# Altium schematic sheet sch power.SchDoc
size A4; SheetNumber: 1; SheetTotal: 1
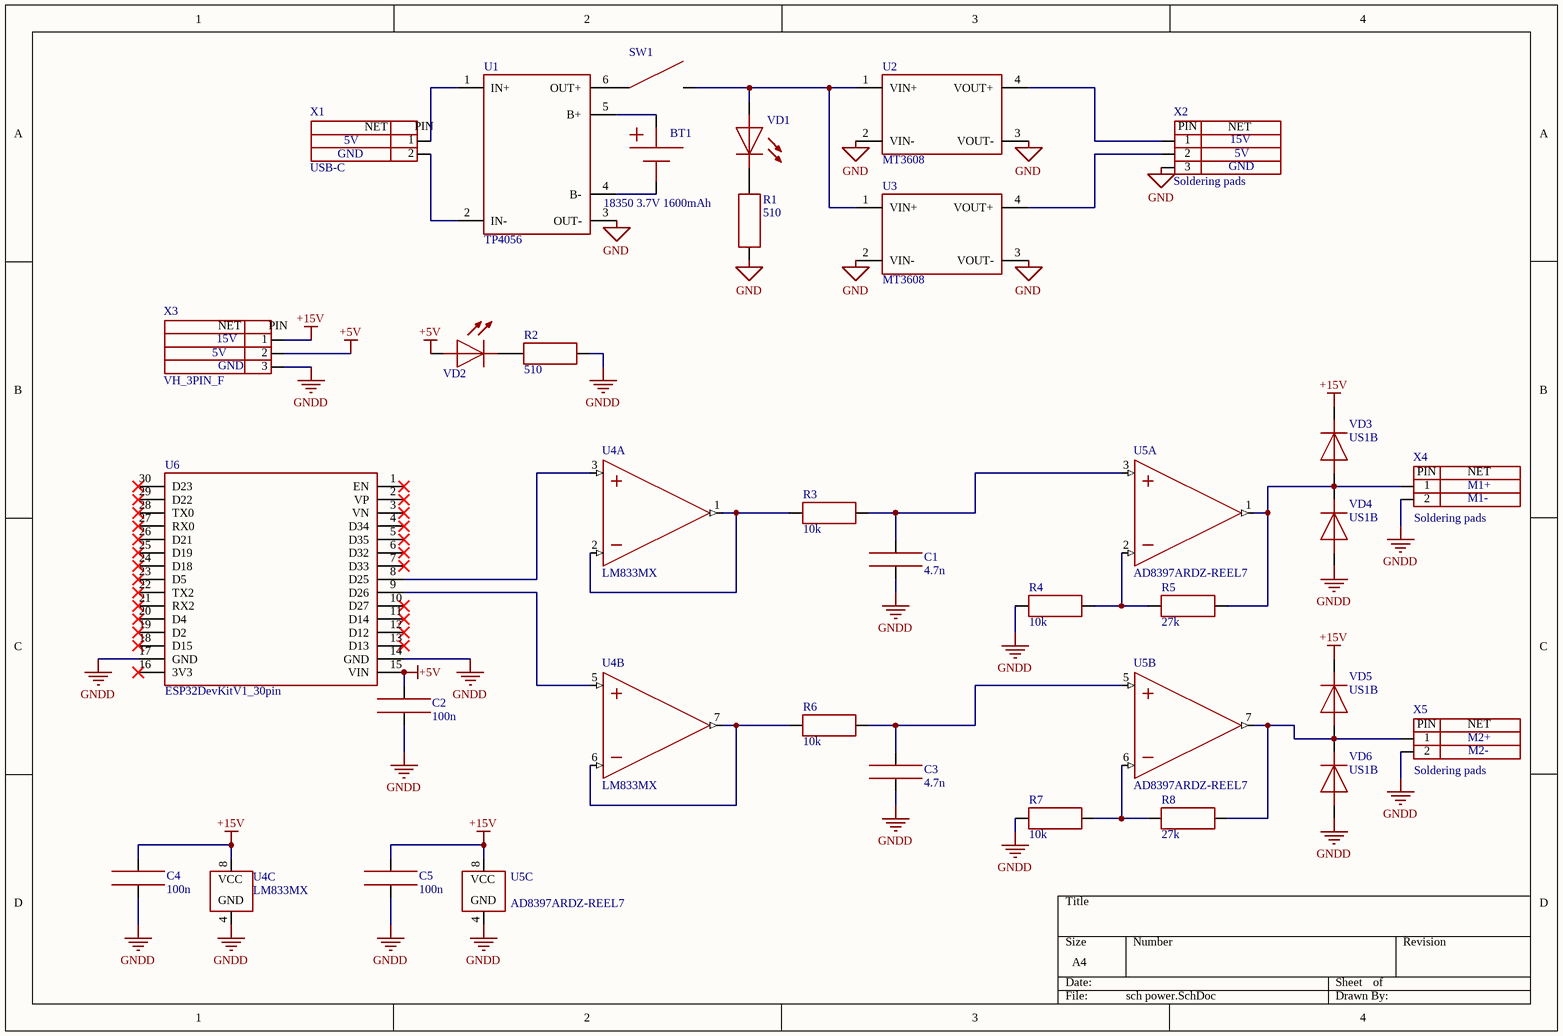
[diagram p0: sch power.SchDoc]

## Parts
BT1  18350 3.7V 1600mAh  (mechanical)
C1  4.7n  [C0805]
C2  100n  [C0805]
C3  4.7n  [C0805]
C4  100n  [C0805]
C5  100n  [C0805]
R1  510  [Res 0.25]  (mechanical)
R2  510  [R0805]
R3  10k  [R0805]
R4  10k  [R0805]
R5  27k  [R0805]
R6  10k  [R0805]
R7  10k  [R0805]
R8  27k  [R0805]
SW1  Switch (Normal Open, 1 Pole)  (value not drawn)  (mechanical)
U1  TP4056  (mechanical)
U2  MT3608  (mechanical)
U3  MT3608  (mechanical)
U4  LM833MX  [SO8]  (parts A,B,C of 3)
U5  AD8397ARDZ-REEL7  [SOIC-8EP]  (parts A,B,C of 3)
U6  ESP32DevKitV1_30pin  [ESP32 DEVKIT V1_30pin]
VD1  5003R4D-EPB-P  [2 PIN]  (value not drawn)  (mechanical)
VD2  5003R4D-EPB-P  [2 PIN]  (value not drawn)
VD3  US1B  [SMA(DO-214AC)]
VD4  US1B  [SMA(DO-214AC)]
VD5  US1B  [SMA(DO-214AC)]
VD6  US1B  [SMA(DO-214AC)]
X1  USB-C  (mechanical)
X2  Soldering pads  (mechanical)
X3  VH_3PIN_F  [VH_3PIN_F]
X4  Soldering pads  [Place 2 (3мм,2мм)]
X5  Soldering pads  [Place 2 (3мм,2мм)]

## Nets
+5V: C2.2 U6.15(VIN) VD2.1(Anode) X3.2(NET2)
+15V: C4.2 C5.2 U4.8(VCC) U5.8(VCC) VD3.2(Cathode) VD5.2(Cathode) X3.1(NET1)
GND: R1.1 U1.3(OUT-) U2.2(VIN-) U2.3(VOUT-) U3.2(VIN-) U3.3(VOUT-) X2.3(NET3)
GNDD: C1.1 C2.1 C3.1 C4.1 C5.1 R2.1 R4.1 R7.1 U4.4(GND) U5.4(GND) U6.14(GND) U6.17(GND) VD4.1(Anode) VD6.1(Anode) X3.3(NET3) X4.2(NET2) X5.2(NET2)
NetBT1_1: BT1.1(Negative) U1.4(B-)
NetBT1_2: BT1.2(Positive) U1.5(B+)
NetC1_2: C1.2 R3.2 U5.3(1IN+)
NetC3_2: C3.2 R6.2 U5.5(2IN+)
NetR1_2: R1.2 VD1.2(Cathode)
NetR2_2: R2.2 VD2.2(Cathode)
NetR3_1: R3.1 U4.1(1OUT) U4.2(1IN-)
NetR4_2: R4.2 R5.1 U5.2(1IN-)
NetR5_2: R5.2 U5.1(1OUT) VD3.1(Anode) VD4.2(Cathode) X4.1(NET1)
NetR6_1: R6.1 U4.6(2IN-) U4.7(2OUT)
NetR7_2: R7.2 R8.1 U5.6(2IN-)
NetR8_2: R8.2 U5.7(2OUT) VD5.1(Anode) VD6.2(Cathode) X5.1(NET1)
NetSW1_1: SW1.1 U1.6(OUT+)
NetSW1_2: SW1.2 U2.1(VIN+) U3.1(VIN+) VD1.1(Anode)
NetU1_1: U1.1(IN+) X1.1(NET1)
NetU1_2: U1.2(IN-) X1.2(NET2)
NetU2_4: U2.4(VOUT+) X2.1(NET1)
NetU3_4: U3.4(VOUT+) X2.2(NET2)
NetU4_3: U4.3(1IN+) U6.8(D25)
NetU4_5: U4.5(2IN+) U6.9(D26)

Not connected (* = marked no-connect by the designer): U6 1(EN)* 2(VP)* 3(VN)* 4(D34)* 5(D35)* 6(D32)* 7(D33)* 10(D27)* 11(D14)* 12(D12)* 13(D13)* 16(3V3)* 18(D15)* 19(D2)* 20(D4)* 21(RX2)* 22(TX2)* 23(D5)* 24(D18)* 25(D19)* 26(D21)* 27(RX0)* 28(TX0)* 29(D22)* 30(D23)*

## Notes on the sheet
- GND
- 5V
- (near X2) GND
- 15V
- (near X3) GND
- (near X4) M1+
- (near X4) M1-
- (near X5) M2+
- M2-
- (in symbol Terminal block (2-pin)) NET; PIN
- (in symbol Terminal block (3-pin)) PIN; NET

## Library data of the parts
BT1 = Battery
C1 C3 = Capacitor: MLCC S0R 50V
C2 C4 C5 = Capacitor: MLCC 50V
R1-R8 = Resistor
U1 = MOD_TP4056: Charger 3.7V
U2 U3 = MOD_MT3608: Boost Converter
U4 U5 = IC_OpAmp_LM358 (Dual)
U6 = MOD_ESP32DevKitV1_30pin
VD1 VD2 = Diode (LED)
VD3-VD6 = Diode
X1 X4 X5 = Terminal block (2-pin)
X2 X3 = Terminal block (3-pin)